# Altium schematic sheet DEBUG_CONSOLE.SchDoc
size 420 x 297 mm; SheetNumber: 17; SheetTotal: 32
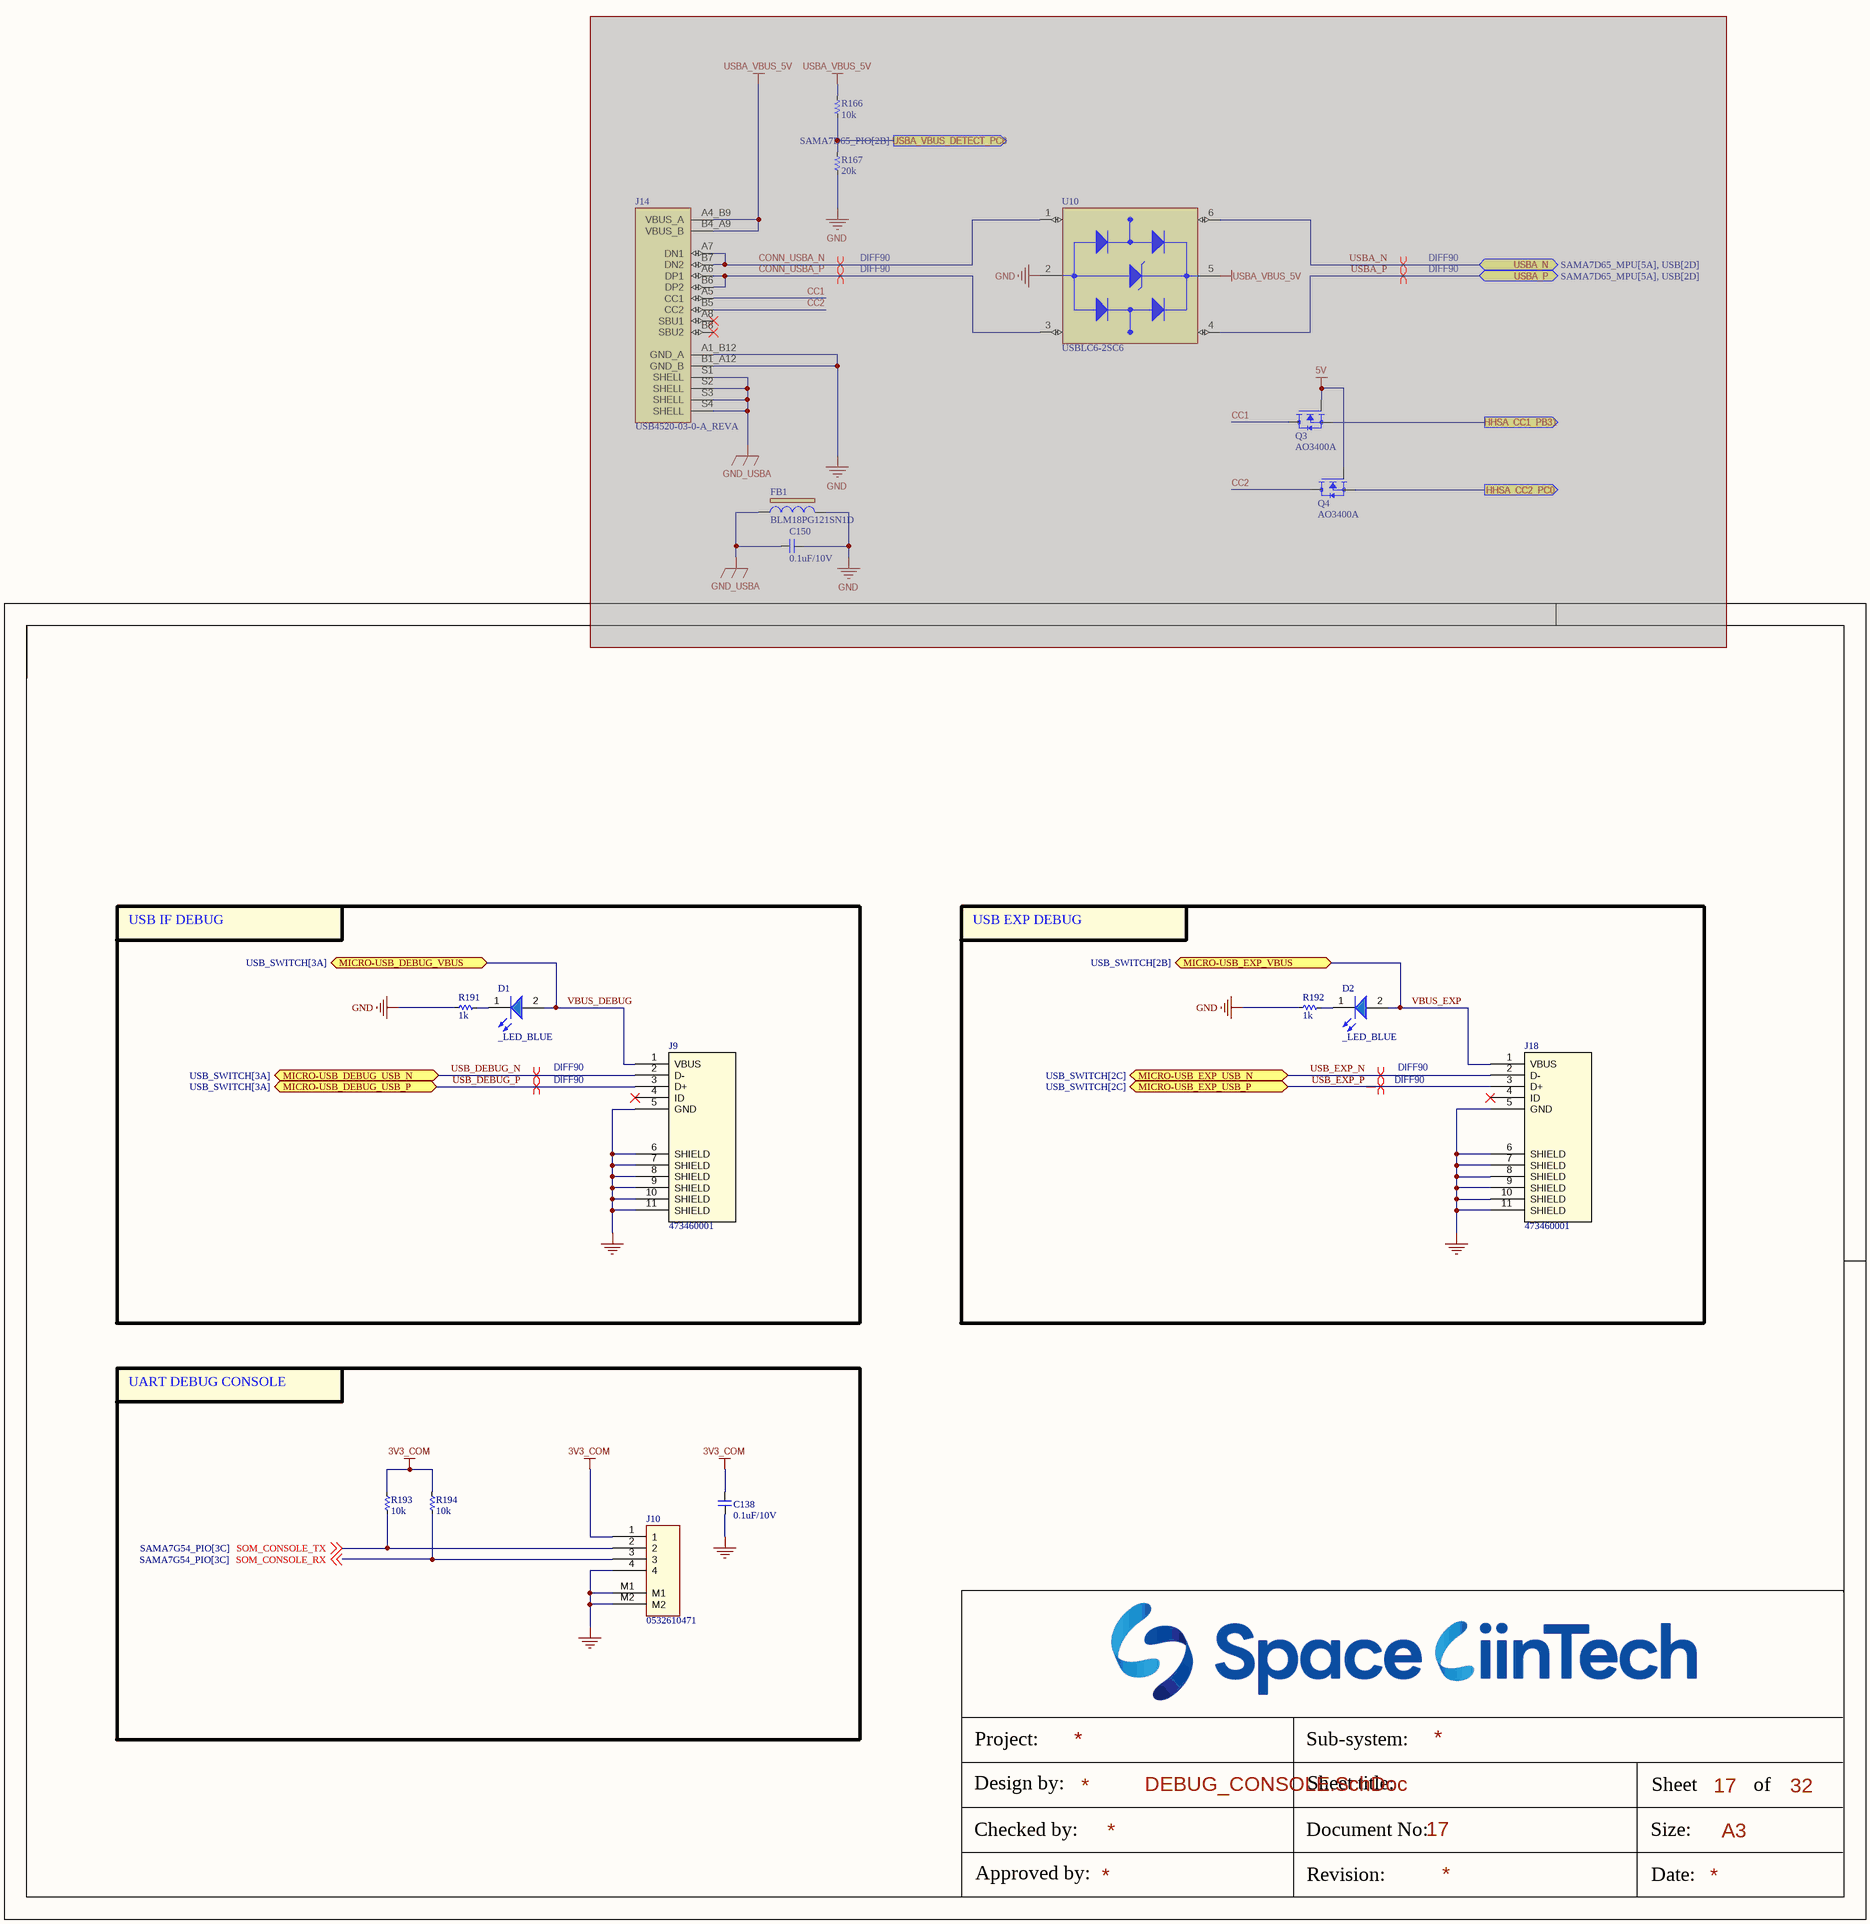
[diagram p0: DEBUG_CONSOLE.SchDoc]

## Parts
C138  0.1uF/10V  [CAP_C_1005X50_L]
C150  0.1uF/10V  [CAP_C_1005X50_L]  (masked out: inside a compile mask, not in the netlist)
D1  _LED_BLUE  [LED_0603]
D2  _LED_BLUE  [LED_0603]
FB1  BLM18PG121SN1D  [IND_BLM18_0603_MUR]  (masked out: inside a compile mask, not in the netlist)
J9  473460001  [47346-0001_MOL]
J10  0532610471  [MOLEX_0532610471]
J14  USB4520-03-0-A_REVA  [GCT_USB4520-03-0-A_REVA]  (masked out: inside a compile mask, not in the netlist)
J18  473460001  [47346-0001_MOL]
Q3  AO3400A  [SOT95P280X125-3N]  (masked out: inside a compile mask, not in the netlist)
Q4  AO3400A  [SOT95P280X125-3N]  (masked out: inside a compile mask, not in the netlist)
R166  10k  [RES_C_1005x30_L]  (masked out: inside a compile mask, not in the netlist)
R167  20k  [RES_C_0603X30]  (masked out: inside a compile mask, not in the netlist)
R191  1k  [RES_C_1005x30_L]
R192  1k  [RES_C_1005x30_L]
R193  10k  [RES_C_1005x30_L]
R194  10k  [RES_C_1005x30_L]
U10  USBLC6-2SC6  [SOT95P280X145-6N]  (masked out: inside a compile mask, not in the netlist)

## Blocks framed on the sheet
USB IF DEBUG: D1 J9 R191
USB EXP DEBUG: D2 J18 R192
UART DEBUG CONSOLE: C138 J10 R193 R194

## Ports
HHSA_CC1_PB31 (out), HHSA_CC2_PC0 (out), MICRO-USB_DEBUG_USB_N (bidir, see USB_SWITCH[3A]), MICRO-USB_DEBUG_USB_P (bidir, see USB_SWITCH[3A]), MICRO-USB_DEBUG_VBUS (bidir, see USB_SWITCH[3A]), MICRO-USB_EXP_USB_N (bidir, see USB_SWITCH[2C]), MICRO-USB_EXP_USB_P (bidir, see USB_SWITCH[2C]), MICRO-USB_EXP_VBUS (bidir, see USB_SWITCH[2B]), USBA_N (bidir, see SAMA7D65_MPU[5A], USB[2D]), USBA_P (bidir, see SAMA7D65_MPU[5A], USB[2D]), USBA_VBUS_DETECT_PC8 (out, see SAMA7D65_PIO[2B])

## Nets
3V3_COM: C138.2 J10.1 R193.1 R194.1
GND: C138.1 J9.5(GND) J9.6(SHIELD) J9.7(SHIELD) J9.8(SHIELD) J9.9(SHIELD) J9.10(SHIELD) J9.11(SHIELD) J10.4 J10.M1 J10.M2 J18.5(GND) J18.6(SHIELD) J18.7(SHIELD) J18.8(SHIELD) J18.9(SHIELD) J18.10(SHIELD) J18.11(SHIELD) R191.1 R192.1
SOM_CONSOLE_RX: J10.3 R194.2 ; off-sheet SOM_CONSOLE_RX
SOM_CONSOLE_TX: J10.2 R193.2 ; off-sheet SOM_CONSOLE_TX
USB_DEBUG_N: J9.2(D-) ; port MICRO-USB_DEBUG_USB_N
USB_DEBUG_P: J9.3(D+) ; port MICRO-USB_DEBUG_USB_P
USB_EXP_N: J18.2(D-) ; port MICRO-USB_EXP_USB_N
USB_EXP_P: J18.3(D+) ; port MICRO-USB_EXP_USB_P
VBUS_DEBUG: D1.2(A) J9.1(VBUS) ; port MICRO-USB_DEBUG_VBUS
VBUS_EXP: D2.2(A) J18.1(VBUS) ; port MICRO-USB_EXP_VBUS
NetD1_1: D1.1(K) R191.2
NetD2_1: D2.1(K) R192.2

Not connected (* = marked no-connect by the designer): J9 4(ID)*; J18 4(ID)*

## Layout directives
differential pair; differential pair class DIFF90; net class DIFF90; rule Matched Net Lengths [Tolerance = 4mil]: (no net found under the mark), USB_DEBUG_N, USB_DEBUG_P, USB_EXP_N, USB_EXP_P

## Notes on the sheet
- Project:
- Sub-system:
- Design by:
- Sheet title:
- Sheet
- A3
- of
- Checked by:
- Approved by:
- Revision:
- Document No:
- Size:
- Date:

## Library data of the parts
C138 C150 = _CAP_C_2: CAP
D1 D2 = LED_BLUE: LED BLUE CLEAR 0603 SMD
FB1 = BLM18PG121SN1D: FERRITE BEAD 120 OHM 0603 1LN; Manufacturer_Name: Murata; Copyright: Copyright (C) 2025 Ultra Librarian. All rights reserved.; Manufacturer_Part_Number: BLM18PG121SN1D
J9 J18 = 473460001: Micro-USB B Receptacle with Flange, Bottom Mount, Surface Mount, Lead-Free; Manufacturer_Name: Molex Connector Corporation; Copyright: Copyright (C) 2025 Ultra Librarian. All rights reserved.; Manufacturer_Part_Number: 473460001; RefDes: RefDes; Type: Type
J10 = Header 4x1_2M
J14 = USB4520-03-0-A_REVA: USB-C (USB TYPE-C) USB 2.0 Receptacle Connector 24 (16+8 Dummy) Position Board Edge, Cutout; Surface Mount; Through Hole, Right Angle; MF: Global Connector Technology; SnapEDA_Link: https://www.snapeda.com/parts/USB4520-03-0-A/Global+Connector+Technology/view-part/?ref=snap; Package: None; Value: *; MP: USB4520-03-0-A; Check_prices: https://www.snapeda.com/parts/USB4520-03-0-A/Global+Connector+Technology/view-part/?ref=eda
Q3 Q4 = AO3400A: N-Channel 30 V 5.7A (Ta) 1.4W (Ta) Surface Mount SOT-23-3; MF: Alpha & Omega Semiconductor; SnapEDA_Link: https://www.snapeda.com/parts/AO3400A/Alpha/view-part/?ref=snap; Package: SOT-23 Alpha &amp; Omega Semiconductor Inc.; Value: *; MP: AO3400A; Check_prices: https://www.snapeda.com/parts/AO3400A/Alpha/view-part/?ref=eda
R166 R167 R191-R194 = _RES_B_2: RES
U10 = USBLC6-2SC6: 17V Clamp 5A (8/20Âµs) Ipp Tvs Diode Surface Mount SOT-23-6; MF: STMicroelectronics; Value: *; SnapEDA_Link: https://www.snapeda.com/parts/USBLC6-2SC6/STMicroelectronics/view-part/?ref=snap; Check_prices: https://www.snapeda.com/parts/USBLC6-2SC6/STMicroelectronics/view-part/?ref=eda; Purchase-URL: https://pricing.snapeda.com/search/part/USBLC6-2SC6/?ref=eda; Price: None; Availability: In Stock; Package: SOT-23-6 STMicroelectronics; MP: USBLC6-2SC6